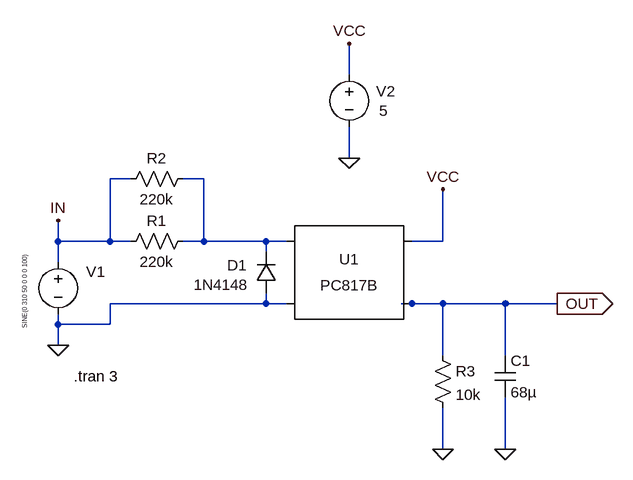
[diagram p0: schematic v1.0.asc]
v1.0.asc, the LTspice schematic file:
Version 4.1
SHEET 1 1060 680
WIRE 224 -128 224 -176
WIRE 224 0 224 -48
WIRE -112 32 -144 32
WIRE 0 32 -32 32
WIRE -224 128 -224 96
WIRE -144 128 -144 32
WIRE -144 128 -224 128
WIRE -112 128 -144 128
WIRE 0 128 0 32
WIRE 0 128 -32 128
WIRE 96 128 0 128
WIRE 128 128 96 128
WIRE 368 128 368 48
WIRE 368 128 320 128
WIRE 96 144 96 128
WIRE -224 160 -224 128
WIRE 96 224 96 208
WIRE 96 224 -144 224
WIRE 128 224 96 224
WIRE 320 224 304 224
WIRE 368 224 320 224
WIRE 464 224 368 224
WIRE 544 224 464 224
WIRE -224 256 -224 240
WIRE -144 256 -144 224
WIRE -144 256 -224 256
WIRE -224 288 -224 256
WIRE 368 304 368 224
WIRE 464 304 464 224
WIRE 368 448 368 384
WIRE 464 448 464 368
FLAG -224 288 0
FLAG 224 0 0
FLAG 544 224 OUT
IOPIN 544 224 Out
FLAG -224 96 IN
FLAG 368 448 0
FLAG 224 -176 VCC
FLAG 368 48 VCC
FLAG 464 448 0
SYMBOL Optos\\PC817B 224 176 R0
SYMATTR InstName U1
SYMBOL res 352 288 R0
SYMATTR InstName R3
SYMATTR Value 10k
SYMBOL voltage -224 144 R0
WINDOW 123 0 0 Left 0
WINDOW 39 0 0 Left 0
WINDOW 0 43 31 Left 2
WINDOW 3 -51 4 VRight 0
SYMATTR InstName V1
SYMATTR Value SINE(0 310 50 0 0 0 100)
SYMBOL res -16 112 R90
WINDOW 0 0 56 VBottom 2
WINDOW 3 32 56 VTop 2
SYMATTR InstName R1
SYMATTR Value 220k
SYMBOL voltage 224 -144 R0
WINDOW 123 0 0 Left 0
WINDOW 39 0 0 Left 0
WINDOW 0 41 41 Left 2
WINDOW 3 46 71 Left 2
SYMATTR InstName V2
SYMATTR Value 5
SYMBOL diode 112 208 R180
WINDOW 0 45 43 Left 2
WINDOW 3 43 13 Left 2
SYMATTR InstName D1
SYMATTR Value 1N4148
SYMBOL cap 448 304 R0
SYMATTR InstName C1
SYMATTR Value 68µ
SYMBOL res -16 16 R90
WINDOW 0 0 56 VBottom 2
WINDOW 3 32 56 VTop 2
SYMATTR InstName R2
SYMATTR Value 220k
TEXT -200 336 Left 2 !.tran 3

The netlist it stands for:
* v1.0.asc
X§U1 N001 0 VCC OUT PC817 Igain=1.5m
R3 OUT 0 10k
V1 IN 0 SINE(0 310 50 0 0 0 100)
R1 N001 IN 220k
V2 VCC 0 5
D1 0 N001 1N4148
C1 OUT 0 68µ
R2 N001 IN 220k
.model D D
.lib standard.dio
.tran 3
.lib PC817.sub
.backanno
.end

* Results of the author's LTspice run, read from the files saved beside the schematic
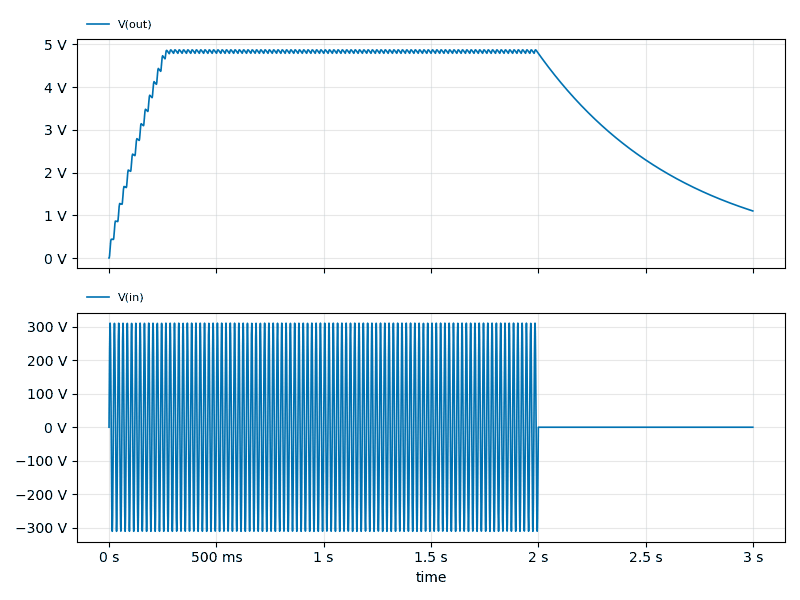
[diagram p1: Transient Analysis of v1.0.asc, plotted from the saved traces]
* Transient Analysis, 1 run:
*   V(out): min 0 V, max 4.874 V, average 3.869 V, rms 4.098 V, last 1.102 V
*   V(in): min -310 V, max 310 V, average -87.45 mV, rms 179.1 V, last 0 V